# Altium schematic sheet [09]-Digital-IO.SchDoc: I²C Digital-IO
size A3; Organization: Toradex AG; Address1: Altsagenstrasse 5; Address2: Horw; Address3: 6048; Address4: Switzerland; DocumentNumber: 8; Revision: V3.2; SheetNumber: 8; SheetTotal: 13; PageSetup: Record=PageOptions|CenterHorizontal=True|CenterVertical=True|PrintScale=0.73|XCorrection=1.00|YCorrection=1.00|PrintKind=0|BorderSize=5000000|LeftOffset=0|BottomOffset=0|Orientation=2|PaperLength=1000|PaperWidth=1000|Scale=100|PaperSource=7|PrintQuality=-4|MediaType=1|DitherType=10|PaperKind=A4|PrintScaleMode=1
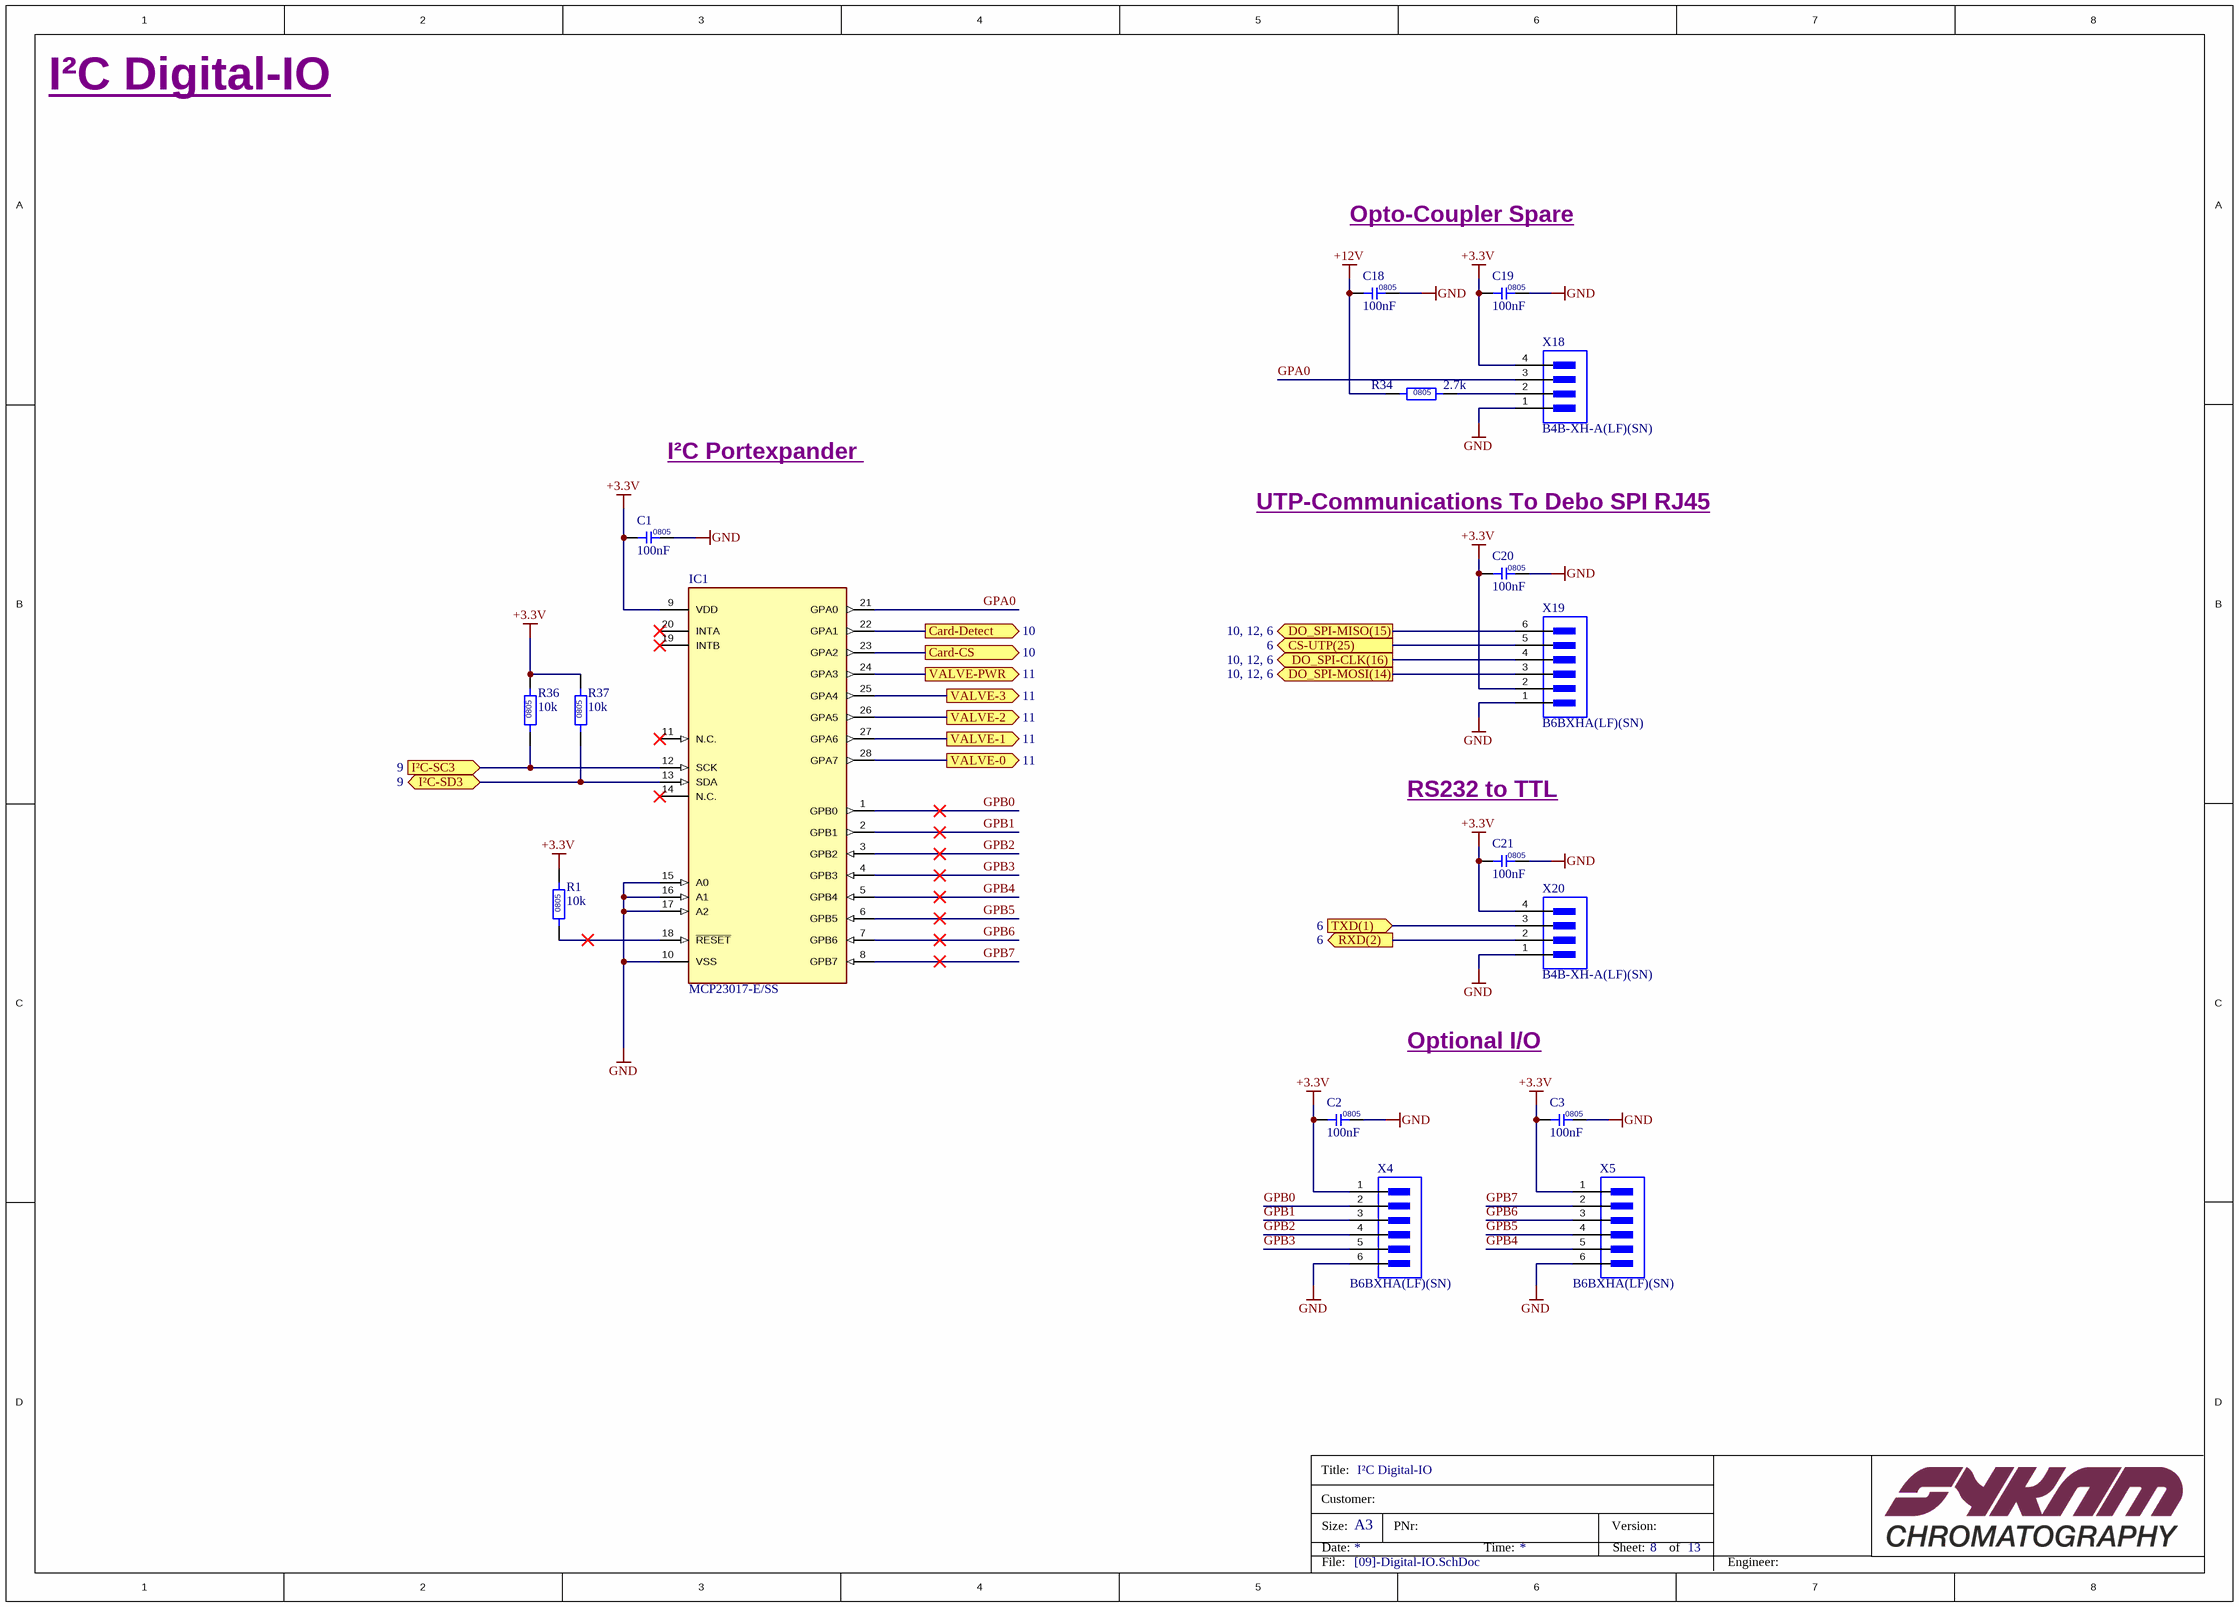
[diagram p0: [09]-Digital-IO.SchDoc]

## Parts
C1  100nF  [C0805]
C2  100nF  [C0805]
C3  100nF  [C0805]
C18  100nF  [C0805]
C19  100nF  [C0805]
C20  100nF  [C0805]
C21  100nF  [C0805]
IC1  MCP23017-E/SS  [IC_MCP23017-E/SS_SSOP28]
R1  10k  [R0805]
R34  2.7k  [R0805]
R36  10k  [R0805]
R37  10k  [R0805]
X4  B6BXHA(LF)(SN)  [B6BXHA(LF)(SN)]
X5  B6BXHA(LF)(SN)  [B6BXHA(LF)(SN)]
X18  B4B-XH-A(LF)(SN)  [CON_B4B-XH-A(LF)(SN)]
X19  B6BXHA(LF)(SN)  [B6BXHA(LF)(SN)]
X20  B4B-XH-A(LF)(SN)  [CON_B4B-XH-A(LF)(SN)]

## Ports
Card-CS (out, see 10), Card-Detect (out, see 10), CS-UTP(25) (out, see 6), DO_SPI-CLK(16) (out, see 10, 12, 6), DO_SPI-MISO(15) (out, see 10, 12, 6), DO_SPI-MOSI(14) (out, see 10, 12, 6), I²C-SC3 (in, see 9), I²C-SD3 (bidir, see 9), RXD(2) (out, see 6), TXD(1) (in, see 6), VALVE-0 (out, see 11), VALVE-1 (out, see 11), VALVE-2 (out, see 11), VALVE-3 (out, see 11), VALVE-PWR (out, see 11)

## Nets
+3.3V: C1.1 C2.1 C3.1 C19.1 C20.1 C21.1 IC1.9(VDD) R1.2 R36.2 R37.2 X4.1 X5.1 X18.4 X19.2 X20.4
+12V: C18.1 R34.1
GND: C1.2 C2.2 C3.2 C18.2 C19.2 C20.2 C21.2 IC1.10(VSS) IC1.15(A0) IC1.16(A1) IC1.17(A2) X4.6 X5.6 X18.1 X19.1 X20.1
Card-CS: IC1.23(GPA2) ; port Card-CS
Card-Detect: IC1.22(GPA1) ; port Card-Detect
CS-UTP(25): X19.5 ; port CS-UTP(25)
DO_SPI-CLK(16): X19.4 ; port DO_SPI-CLK(16)
DO_SPI-MISO(15): X19.6 ; port DO_SPI-MISO(15)
DO_SPI-MOSI(14): X19.3 ; port DO_SPI-MOSI(14)
GPA0: IC1.21(GPA0) X18.3
GPB0: IC1.1(GPB0) X4.2
GPB1: IC1.2(GPB1) X4.3
GPB2: IC1.3(GPB2) X4.4
GPB3: IC1.4(GPB3) X4.5
GPB4: IC1.5(GPB4) X5.5
GPB5: IC1.6(GPB5) X5.4
GPB6: IC1.7(GPB6) X5.3
GPB7: IC1.8(GPB7) X5.2
I²C-SC3: IC1.12(SCK) R36.1 ; port I²C-SC3
I²C-SD3: IC1.13(SDA) R37.1 ; port I²C-SD3
RXD(2): X20.2 ; port RXD(2)
TXD(1): X20.3 ; port TXD(1)
VALVE-0: IC1.28(GPA7) ; port VALVE-0
VALVE-1: IC1.27(GPA6) ; port VALVE-1
VALVE-2: IC1.26(GPA5) ; port VALVE-2
VALVE-3: IC1.25(GPA4) ; port VALVE-3
VALVE-PWR: IC1.24(GPA3) ; port VALVE-PWR
NetIC1_18: IC1.18(~{RESET}) R1.1
NetR34_2: R34.2 X18.2

Not connected (* = marked no-connect by the designer): IC1 11(N.C.)* 14(N.C.)* 19(INTB)* 20(INTA)*

## Notes on the sheet
- Opto-Coupler Spare
- I²C Portexpander
- UTP-Communications To Debo SPI RJ45
- RS232 to TTL
- Optional I/O
- Title:
- Customer:
- Size:
- Date:
- A3
- PNr:
- Time:
- Version:
- Sheet:
- of
- File:
- Engineer:
- Title
- Number:
- Revision:
- Sheet

## Library data of the parts
C1-C3 C18-C21 = C_100nF_CC0805KRX7R9BB104: CAP CER 0.1UF 50V X7R 0805; Manufacturer: Yageo; Material: Ceramic; Tolerance: 10%; Insulation Resistance: 100GR; PCBChecked: initials after Checked; Supplier 1: Digi-Key; Manufacturer Part Number: CC0805KRX7R9BB104; RoHS: Yes; Category: Ceramic Capacitors; Mount: Surface Mount; Case/Package: 0805; Number of Pins: 2; Case Code (Metric): 2012; Case Code (Imperial): 0805; Min Operating Temperature: -55°C; Max Operating Temperature: 125°C; Packaging: Tape and Reel; Capacitance: 100nF; Voltage Rating: 50V; Package Quantity: 1; Dielectric: X7R; Termination: SMD/SMT; Voltage: 50V; Length: 2mm; Height: 0.85mm; Width: 0.049inch; Thickness: 0.033inch; Depth: 1.25mm; Radiation Hardening: No; REACH SVHC: No SVHC; Lead Free: Lead Free; Halogen Free: Halogen Free; ComponentLink1URL: https://datasheet.ciiva.com/11786/0900766b80d84f1d-11786009.pdf?src-supplier=RSComponents; ComponentLink1Description: https://datasheet.ciiva.com/11786/0900766b80d84f1d-11786009.pdf?src-supplier=RSComponents; ComponentLink2URL: https://datasheet.ciiva.com/11464/upy-gphc-x7r-6-3v-to-50v-8-11464757.pdf?src-supplier=Avnet; ComponentLink2Description: https://datasheet.ciiva.com/11464/upy-gphc-x7r-6-3v-to-50v-8-11464757.pdf?src-supplier=Avnet; ComponentLink3URL: https://datasheet.ciiva.com/28450/1489800-28450805.pdf?src-supplier=Element14; ComponentLink3Description: https://datasheet.ciiva.com/28450/1489800-28450805.pdf?src-supplier=Element14; ComponentLink4URL: https://datasheet.ciiva.com/155/mlccorderingcode-155929.pdf?src-supplier=Digi-Key; ComponentLink4Description: https://datasheet.ciiva.com/155/mlccorderingcode-155929.pdf?src-supplier=Digi-Key; ComponentLink5URL: https://datasheet.ciiva.com/155/mlccorderingcode-155930.pdf?src-supplier=Digi-Key; ComponentLink5Description: https://datasheet.ciiva.com/155/mlccorderingcode-155930.pdf?src-supplier=Digi-Key; ComponentLink6URL: https://datasheet.ciiva.com/155/mlccorderingcode-155931.pdf?src-supplier=Digi-Key; ComponentLink6Description: https://datasheet.ciiva.com/155/mlccorderingcode-155931.pdf?src-supplier=Digi-Key; ComponentLink7URL: https://datasheet.ciiva.com/46393/1734573-46393307.pdf?src-supplier=Element14; ComponentLink7Description: https://datasheet.ciiva.com/46393/1734573-46393307.pdf?src-supplier=Element14; ComponentLink8URL: https://datasheet.ciiva.com/16625/upy-gphc-x7r-6-3v-to-50v-8-16625549.pdf?src-supplier=Avnet+Europe; ComponentLink8Description: https://datasheet.ciiva.com/16625/upy-gphc-x7r-6-3v-to-50v-8-16625549.pdf?src-supplier=Avnet+Europe; ComponentLink9URL: https://datasheet.ciiva.com/29242/445210-da-01-en-kerko-chip-0805-x7r-0-1uf-10proz-50vg-29242074.pdf?src-supplier=Conrad; ComponentLink9Description: https://datasheet.ciiva.com/29242/445210-da-01-en-kerko-chip-0805-x7r-0-1uf-10proz-50vg-29242074.pdf?src-supplier=Conrad; Supplier Part Number 1: 311-1140-6-ND; Stock 1: 7118979; IPC7352C: done; SCHChecked: Initials after checked
IC1 = IC_MCP23017-E/SS: I²C Bus IC Operating temperature: -40...+125 °C Power supply: 1.8...5.5 V Package: SSOP-20; Manufacturer: Microchip; Interface: I2C,Serial; Min Supply Voltage: 4.5V; Max Supply Voltage: 5.5V; Number of Channels: 1; Nominal Supply Current: 1mA; Output Current: 25mA; Max Power Dissipation: 700mW; Number of I/Os: 16; Max Frequency: 1.7MHz; Output Type: PUSH-PULL; Supplier 1: Farnell; Manufacturer Part Number: MCP23017-E/SS; RoHS: Yes; Category: Interface ICs; Stock 1: 15856; Pricing 1: 1=2,13000, 25=1,60000, 100=1,57000 (EUR); Mount: Surface Mount; Case/Package: SSOP; Number of Pins: 28; Weight: 0.080001oz; Min Operating Temperature: -40°C; Max Operating Temperature: 125°C; Series: -; Packaging: Rail/Tube; Frequency: 1.7MHz; Number of Bits: 16; Supply Voltage-Nom: 5.5V; Supply Current: 1mA; Reach SVHC Compliant: Yes; Lead Free: Lead Free; RoHS Compliant: Yes; ComponentLink1URL: https://datasheet.ciiva.com/1495/12179-1495878.pdf?src-supplier=Element14; ComponentLink1Description: https://datasheet.ciiva.com/1495/12179-1495878.pdf?src-supplier=Element14; ComponentLink2URL: https://datasheet.ciiva.com/3149/21952b-3149160.pdf?src-supplier=Avnet; ComponentLink2Description: https://datasheet.ciiva.com/3149/21952b-3149160.pdf?src-supplier=Avnet; ComponentLink3URL: https://datasheet.ciiva.com/1780/21952b-1780093.pdf?src-supplier=Digi-Key; ComponentLink3Description: https://datasheet.ciiva.com/1780/21952b-1780093.pdf?src-supplier=Digi-Key; ComponentLink4URL: https://datasheet.ciiva.com/16454/filehandler-aspxddocname-en023709-16454261.pdf?src-supplier=Future+Electronics; ComponentLink4Description: https://datasheet.ciiva.com/16454/filehandler-aspxddocname-en023709-16454261.pdf?src-supplier=Future+Electronics; Supplier Part Number 1: 1467674
R1 R36 R37 = R_10k_RC0805FR-0710KL: RES SMD 10K OHM 1% 1/8W 0805; Manufacturer: Yageo; Temperature Coefficient: 100ppm/°C; Resistance: 10kR; Power Rating: 125mW; Voltage Rating: 150V; PCBChecked: initials after Checked; Supplier 1: Digi-Key; Manufacturer Part Number: RC0805FR-0710KL; RoHS: Yes; Category: Chip SMD Resistors; Case/Package: 0805; Case Code (Imperial): 0805; Case Code (Metric): 2012; Min Operating Temperature: -55°C; Max Operating Temperature: 155°C; Packaging: Tape and Reel; Tolerance: 1%; Composition: Thick Film; Features: Moisture Resistant; Termination: SMD/SMT; Number of Terminations: 2; Military Standard: Not; Max Power Dissipation: 125mW; Package Quantity: 1; Length: 2mm; Height: 0.024inch; Width: 0.049inch; Depth: 1.25mm; Lead Free: Lead Free; REACH SVHC: Unknown; ComponentLink1URL: https://datasheet.ciiva.com/11808/0900766b8106beab-11808151.pdf?src-supplier=RSComponents; ComponentLink1Description: https://datasheet.ciiva.com/11808/0900766b8106beab-11808151.pdf?src-supplier=RSComponents; ComponentLink2URL: https://datasheet.ciiva.com/12669/rc0805-12669688.pdf?src-supplier=Mouser; ComponentLink2Description: https://datasheet.ciiva.com/12669/rc0805-12669688.pdf?src-supplier=Mouser; ComponentLink3URL: https://datasheet.ciiva.com/2456/pyu-r-int-thick-7-2456973.pdf?src-supplier=Digi-Key; ComponentLink3Description: https://datasheet.ciiva.com/2456/pyu-r-int-thick-7-2456973.pdf?src-supplier=Digi-Key; ComponentLink4URL: https://datasheet.ciiva.com/16747/rc0805-16747087.pdf?src-supplier=Future+Electronics; ComponentLink4Description: https://datasheet.ciiva.com/16747/rc0805-16747087.pdf?src-supplier=Future+Electronics; ComponentLink5URL: https://datasheet.ciiva.com/46447/444164-46447563.pdf?src-supplier=Element14; ComponentLink5Description: https://datasheet.ciiva.com/46447/444164-46447563.pdf?src-supplier=Element14; ComponentLink6URL: https://datasheet.ciiva.com/2456/pyu-r-int-thick-7-2456972.pdf?src-supplier=Digi-Key; ComponentLink6Description: https://datasheet.ciiva.com/2456/pyu-r-int-thick-7-2456972.pdf?src-supplier=Digi-Key; ComponentLink7URL: https://datasheet.ciiva.com/2456/pyu-r-int-thick-7-2456974.pdf?src-supplier=Digi-Key; ComponentLink7Description: https://datasheet.ciiva.com/2456/pyu-r-int-thick-7-2456974.pdf?src-supplier=Digi-Key; Supplier Part Number 1: 311-10.0KCRCT-ND; Stock 1: 31284302; IPC7352C: done; SCHChecked: Initials after checked
R34 = R_2.7k_RT0805FRE072K7L: YAGEO (PHYCOMP)   RT0805FRE072K7L   Surface Mount Chip Resistor, Thin Film, RT Series, 2.7 kohm, 125 mW,  1%, 150 V; Resistance: 2.7kR; Temperature Coefficient: 50ppm/°C; Power Rating: 125mW; Voltage Rating: 150V; Supplier 1: Farnell; Manufacturer: Yageo; Manufacturer Part Number: RT0805FRE072K7L; RoHS: Yes; Category: Chip SMD Resistors; Stock 1: 4023; Pricing 1: 10=0,11500, 100=0,03970, 500=0,03190, 1000=0,02410 (EUR); Case/Package: 0805; Contact Plating: Tin,Matte; Case Code (Metric): 2012; Case Code (Imperial): 0805; Min Operating Temperature: -55°C; Max Operating Temperature: 125°C; Tolerance: 1%; Resistor Type: Thin Film; Package Quantity: 5000; Packaging: Tape and Reel; Number of Terminations: 2; Max Power Dissipation: 125mW; Voltage Rating (DC): 150V; Series: RT; Resistance Tolerance: 1%; Construction: Rectangular; Length: 0.079inch; Width: 0.049inch; Height: 0.024inch; Depth: 1.25mm; Radiation Hardening: No; REACH SVHC: Unknown; Military Standard: Not; Lead Free: Lead Free; RoHS Compliant: Yes; ComponentLink1URL: https://datasheet.ciiva.com/2561/pyu-rt-1-to-0-05-rohs-l-5-2561137.pdf?src-supplier=Digi-Key; ComponentLink1Description: https://datasheet.ciiva.com/2561/pyu-rt-1-to-0-05-rohs-l-5-2561137.pdf?src-supplier=Digi-Key; ComponentLink2URL: https://datasheet.ciiva.com/7942/1392914-7942127.pdf?src-supplier=Element14; ComponentLink2Description: https://datasheet.ciiva.com/7942/1392914-7942127.pdf?src-supplier=Element14; Supplier Part Number 1: 1500699
X4 X5 X19 = CON_6pol_B6BXHA(LF)(SN): CONN HEADER VERT 6POS 2.5MM; Manufacturer: JST; Current Rating: 3A; Number of Positions: 6; Contact Resistance: 20mR; Max Voltage Rating (AC): 250V; Connector Type: Male Pin; Insulation Resistance: 1GR; Wire/Cable Gauge: 22AWG; Supplier 1: Digi-Key; Manufacturer Part Number: B6BXHA(LF)(SN); RoHS: Yes; Category: FFC / FPC; Mount: Through Hole; Contact Plating: Tin,Lead,Copper; Contact Material: Brass; Color: Natural; Housing Color: White; Housing Material: Polyamide; Min Operating Temperature: -25°C; Max Operating Temperature: 85°C; Termination: Press-Fit; Number of Rows: 1; Max Current Rating: 3A; Packaging: Bulk; Orientation: Straight; Voltage Rating (AC): 250V; Voltage Rating: 250V; Number of Contacts: 6; Max Voltage Rating (DC): 250V; Package Quantity: 500; Length: 17.4mm; Pitch: 2.5mm; Depth: 5.75mm; Lead Pitch: 2.5mm; Lead Free: Lead Free; REACH SVHC: No SVHC; ComponentLink1URL: https://datasheet.ciiva.com/26894/getdatasheetpartid-424647-26894806.pdf?src-supplier=Verical; ComponentLink1Description: https://datasheet.ciiva.com/26894/getdatasheetpartid-424647-26894806.pdf?src-supplier=Verical; ComponentLink2URL: https://datasheet.ciiva.com/26894/getdatasheetpartid-641012-26894489.pdf?src-supplier=Verical; ComponentLink2Description: https://datasheet.ciiva.com/26894/getdatasheetpartid-641012-26894489.pdf?src-supplier=Verical; ComponentLink3URL: https://datasheet.ciiva.com/20207/523653-20207177.pdf?src-supplier=Rapid+Electronics; ComponentLink3Description: https://datasheet.ciiva.com/20207/523653-20207177.pdf?src-supplier=Rapid+Electronics; ComponentLink4URL: https://datasheet.ciiva.com/16397/b6b-xh-alfsn-16397116.pdf?src-supplier=Future+Electronics; ComponentLink4Description: https://datasheet.ciiva.com/16397/b6b-xh-alfsn-16397116.pdf?src-supplier=Future+Electronics; ComponentLink5URL: https://datasheet.ciiva.com/712/exh-712511.pdf?src-supplier=Digi-Key; ComponentLink5Description: https://datasheet.ciiva.com/712/exh-712511.pdf?src-supplier=Digi-Key; Supplier Part Number 1: 455-2271-ND
X18 X20 = CON_4pol_B4B-XH-A(LF)(SN): JST (JAPAN SOLDERLESS TERMINALS) - B4B-XH-A (LF)(SN) - Wire-To-Board-Steckverbinder, vertikal, 2.5 mm, 4 Kontakt(e), Stiftleiste, Baureihe XH; Connector Type: Male Pin; Number of Positions: 4; Gender: Male; Contact Resistance: 20mR; Current Rating: 3A; Max Voltage Rating (AC): 250V; Insulation Resistance: 1GR; Pitch: 2.5mm; Wire/Cable Gauge: 22AWG; Supplier 1: Newark; Manufacturer: JST; Manufacturer Part Number: B4B-XH-A(LF)(SN); RoHS: Yes; Category: FFC / FPC; Mount: Through Hole; Contact Plating: Tin,Copper,Lead; Contact Material: Brass; Color: Natural; Housing Material: Polyamide; Housing Color: White; Material: Polyamide; Min Operating Temperature: -25°C; Max Operating Temperature: 85°C; Number of Rows: 1; Packaging: Bulk; Termination: Press-Fit; Max Current Rating: 3A; Package Quantity: 500; Orientation: Straight; Voltage Rating (AC): 250V; Voltage Rating: 250V; Max Voltage Rating (DC): 250V; Number of Contacts: 4; Length: 12.4mm; Depth: 5.75mm; Lead Pitch: 2.5mm; Lead Free: Lead Free; REACH SVHC: No SVHC; ComponentLink1URL: https://datasheet.ciiva.com/26894/getdatasheetpartid-455616-26894787.pdf?src-supplier=Verical; ComponentLink1Description: https://datasheet.ciiva.com/26894/getdatasheetpartid-455616-26894787.pdf?src-supplier=Verical; ComponentLink2URL: https://datasheet.ciiva.com/26924/getdatasheetpartid-640571-26924035.pdf?src-supplier=Verical; ComponentLink2Description: https://datasheet.ciiva.com/26924/getdatasheetpartid-640571-26924035.pdf?src-supplier=Verical; ComponentLink3URL: https://datasheet.ciiva.com/16203/b4b-xh-alfsn-16203642.pdf?src-supplier=Future+Electronics; ComponentLink3Description: https://datasheet.ciiva.com/16203/b4b-xh-alfsn-16203642.pdf?src-supplier=Future+Electronics; ComponentLink4URL: https://datasheet.ciiva.com/726/exh-726404.pdf?src-supplier=Digi-Key; ComponentLink4Description: https://datasheet.ciiva.com/726/exh-726404.pdf?src-supplier=Digi-Key; Supplier Part Number 1: 73M9436